# EAGLE design drive (EAGLE 5.11)
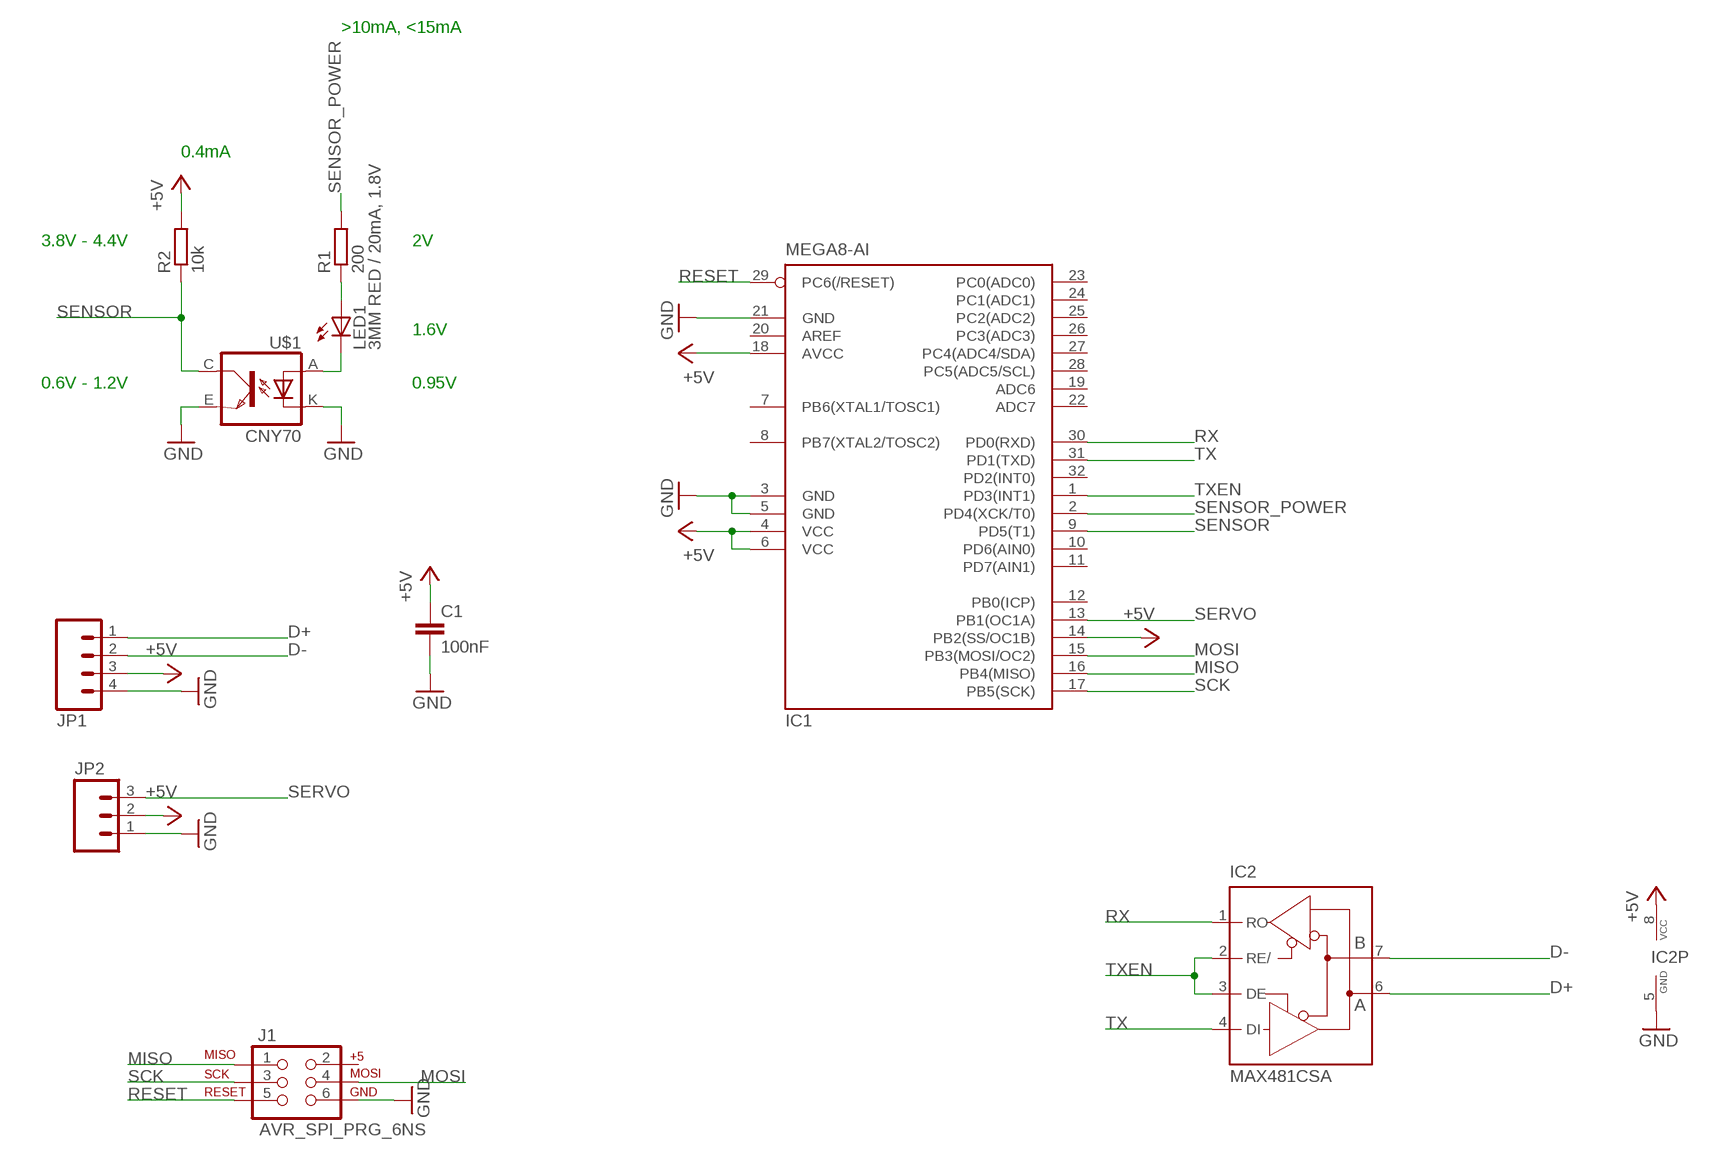
[diagram p0: schematic, sheet 1]

## Parts
C1  100nF  C-EUC0805  [C0805]
IC1  MEGA8-AI  [TQFP32-08]
IC2  MAX481CSA  [SO08]
J1  AVR_SPI_PRG_6NS  [2X3-NS]
JP1  M04POLAR  [MOLEX-1X4]
JP2  M03PTH  [1X03]
LED1  3MM RED / 20mA, 1.8V  LED3MM  [LED3MM]
R1  200  R-EU_R0805  [R0805]
R2  10k  R-EU_R0805  [R0805]
U$1  CNY70  [4]

## Nets
+5V: C1.1 IC1.4(VCC) IC1.6(VCC) IC1.14(PB2(SS/OC1B)) IC1.18(AVCC) IC2.8(VCC) JP1.3 JP2.2 R2.2
D+: IC2.6(A) JP1.1
D-: IC2.7(B) JP1.2
GND: C1.2 IC1.3(GND) IC1.5(GND) IC1.21(GND) IC2.5(GND) J1.6 JP1.4 JP2.1 U$1.E(EMI) U$1.K(C)
MISO: IC1.16(PB4(MISO)) J1.1
MOSI: IC1.15(PB3(MOSI/OC2)) J1.4
N$2: LED1.K(C) U$1.A
N$3: LED1.A R1.1
RESET: IC1.29(PC6(/RESET)) J1.5
RX: IC1.30(PD0(RXD)) IC2.1(RO)
SCK: IC1.17(PB5(SCK)) J1.3
SENSOR: IC1.9(PD5(T1)) R2.1 U$1.C(COL)
SENSOR_POWER: IC1.2(PD4(XCK/T0)) R1.2
SERVO: IC1.13(PB1(OC1A)) JP2.3
TX: IC1.31(PD1(TXD)) IC2.4(DI)
TXEN: IC1.1(PD3(INT1)) IC2.2(RE/) IC2.3(DE)
Unconnected: IC1.7(PB6(XTAL1/TOSC1)) IC1.8(PB7(XTAL2/TOSC2)) IC1.10(PD6(AIN0)) IC1.11(PD7(AIN1)) IC1.12(PB0(ICP)) IC1.19(ADC6) IC1.20(AREF) IC1.22(ADC7) IC1.23(PC0(ADC0)) IC1.24(PC1(ADC1)) IC1.25(PC2(ADC2)) IC1.26(PC3(ADC3)) IC1.27(PC4(ADC4/SDA)) IC1.28(PC5(ADC5/SCL)) IC1.32(PD2(INT0)) J1.2

## Notes on the sheet
- >10mA, <15mA
- 0.4mA
- 3.8V - 4.4V | 2V
- 1.6V
- 0.6V - 1.2V | 0.95V

## Library data of the parts
C1 = rcl:C-EU: CAPACITOR, European symbol
IC1 = atmel:MEGA8: MICROCONTROLLER 8 Kbytes FLASH, 1 kbytes SRAM, 512 bytes EEPROM, USART, 6-channel 10 bit ADC, 2-channel 8 bit ADC Pin compatible with Atmega48, ATMega88, ATMega168 Source: avr.lbr; MPN: ATMEGA8-16AU; OC_FARNELL: 9171371; OC_NEWARK: 73M8863
IC2 = maxim:MAX481CSA: RS485 TRANSEIVER; MF: MAXIM; MPN: MAX481CSA; OC_FARNELL: unknown; OC_NEWARK: 90C3817
J1 = SparkFun:AVR_SPI_PRG_6: AVR ISP 6 Pin This is the reduced ISP connector for AVR programming. Common on Arduino. This footprint will take up less PCB space and can be used with a 10-pin to 6-pin adapter such as SKU: BOB-08508
JP1 = SparkFun:M04: Header 4 Standard 4-pin 0.1" header. Use with straight break away headers (SKU : PRT-00116), right angle break away headers (PRT-00553), swiss pins (PRT-00743), machine pins (PRT-00117), and female headers (PRT-00115). Molex polarized connector foot print use with SKU : PRT-08231 with associated crimp pins and housings.
JP2 = SparkFun:M03: Header 3 Standard 3-pin 0.1" header. Use with straight break away headers (SKU : PRT-00116), right angle break away headers (PRT-00553), swiss pins (PRT-00743), machine pins (PRT-00117), and female headers (PRT-00115). Molex polarized connector foot print use with SKU : PRT-08232 with associated crimp pins and housings.
LED1 = led:LED: LED OSRAM: - CHIPLED LG R971, LG N971, LY N971, LG Q971, LY Q971, LO R971, LY R971 LH N974, LH R974 LS Q976, LO Q976, LY Q976 LO Q996 - Hyper CHIPLED LW Q18S LB Q993, LB Q99A, LB R99A - SideLED LS A670, LO A670, LY A670, LG A670, LP A670 LB A673, LV A673, LT A673, LW A673 LH A674 LY A675 LS A676, LA A676, LO A676, LY A676, LW A676 LS A679, LY A679, LG A679 - Hyper Micro SIDELED® LS Y876, LA Y876, LO Y876, LY Y876 LT Y87S - SmartLED LW L88C, LW L88S LB L89C, LB L89S, LG L890 LS L89K, LO L89K, LY L89K LS L896, LA L896, LO L896, LY L896 - TOPLED LS T670, LO T670, LY T670, LG T670, LP T670 LSG T670, LSP T670, LSY T670, LOP T670, LYG T670 LG T671, LOG T671, LSG T671 LB T673, LV T673, LT T673, LW T673 LH T674 LS T676, LA T676, LO T676, LY T676, LB T676, LH T676, LSB T676, LW T676 LB T67C, LV T67C, LT T67C, LS T67K, LO T67K, LY T67K, LW E67C LS E67B, LA E67B, LO E67B, LY E67B, LB E67C, LV E67C, LT E67C LW T67C LS T679, LY T679, LG T679 LS T770, LO T770, LY T770, LG T770, LP T770 LB T773, LV T773, LT T773, LW T773 LH T774 LS E675, LA E675, LY E675, LS T675 LS T776, LA T776, LO T776, LY T776, LB T776 LHGB T686 LT T68C, LB T68C - Hyper Mini TOPLED® LB M676 - Mini TOPLED Santana® LG M470 LS M47K, LO M47K, LY M47K Source: http://www.osram.convergy.de LUXEON: - LUMILED® LXK2-PW12-R00, LXK2-PW12-S00, LXK2-PW14-U00, LXK2-PW14-V00 LXK2-PM12-R00, LXK2-PM12-S00, LXK2-PM14-U00 LXK2-PE12-Q00, LXK2-PE12-R00, LXK2-PE12-S00, LXK2-PE14-T00, LXK2-PE14-U00 LXK2-PB12-K00, LXK2-PB12-L00, LXK2-PB12-M00, LXK2-PB14-N00, LXK2-PB14-P00, LXK2-PB14-Q00 LXK2-PR12-L00, LXK2-PR12-M00, LXK2-PR14-Q00, LXK2-PR14-R00 LXK2-PD12-Q00, LXK2-PD12-R00, LXK2-PD12-S00 LXK2-PH12-R00, LXK2-PH12-S00 LXK2-PL12-P00, LXK2-PL12-Q00, LXK2-PL12-R00 Source: www.luxeon.com KINGBRIGHT: KA-3528ASYC Source: www.kingbright.com
R1 R2 = rcl:R-EU_: RESISTOR, European symbol
U$1 = cny70:CNY70

## Board
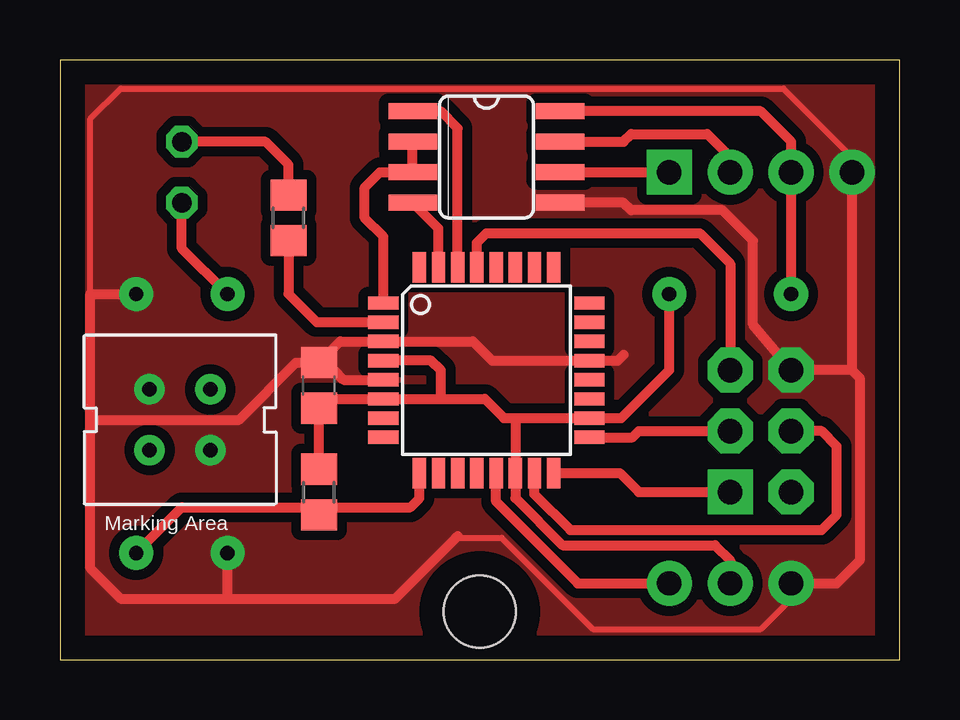
[diagram p1: board, top side]
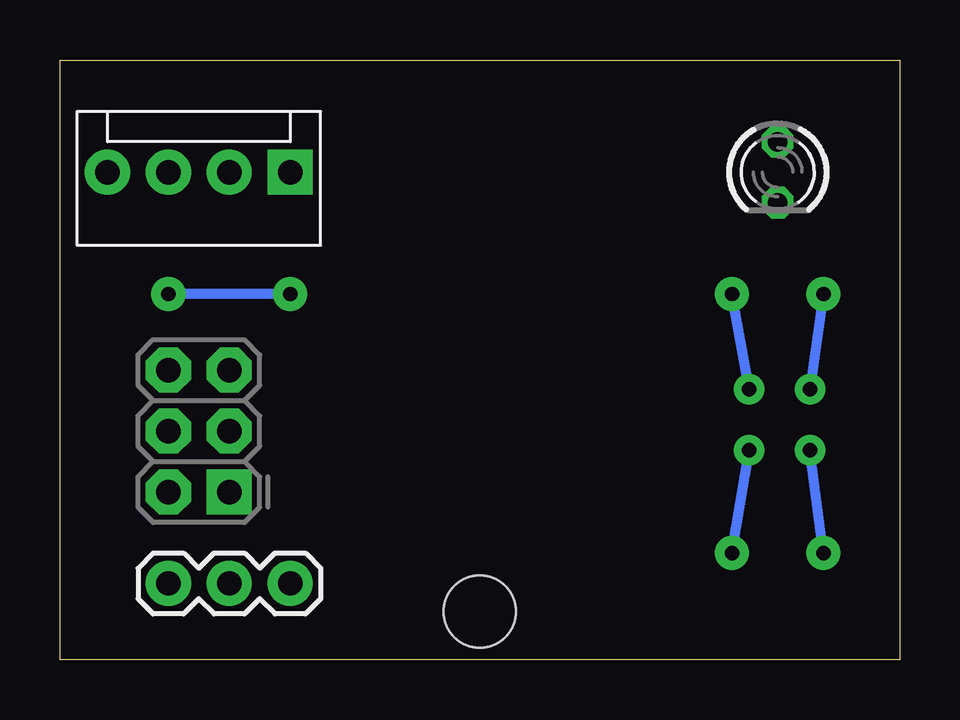
[diagram p2: board, bottom side, seen from below]

Size 35 x 25 mm. Coordinates in mm from the lower left corner, seen from the top.
Outline: 0,0 35,0 35,25 0,25 0,0
Copper layers (1*16): Top 0.035mm / dielectric 1.5mm / Bottom 0.035mm
Design rules "default *": minimum track width 0.25mm, minimum drill 0.5mm, track to track 8mil, track to pad 8mil, pad to pad 8mil, via to via 8mil, smd to smd 8mil, copper to edge 40mil, drill to drill 8mil, minimum pad ring 10mil, minimum via ring 8mil, stop-mask expansion 4mil, vias tented up to drill 0mil, thermal gap 10mil
Holes 3 mm at 17.5,2

### Footprints (pad centres in the part's own frame; a part is rotated, then mirrored left to right if it is on the bottom)
C0805 = smd 1.3 x 1.5: 1 -0.95,0; 2 0.95,0
TQFP32-08 = smd 1.27 x 0.559: 1 -4.293,2.8; 2 -4.293,2; 3 -4.293,1.2; 4 -4.293,0.4; 5 -4.293,-0.4; 6 -4.293,-1.2; 7 -4.293,-2; 8 -4.293,-2.8; 17 4.293,-2.8; 18 4.293,-2; 19 4.293,-1.2; 20 4.293,-0.4; 21 4.293,0.4; 22 4.293,1.2; 23 4.293,2; 24 4.293,2.8 | smd 0.559 x 1.27: 9 -2.8,-4.293; 10 -2,-4.293; 11 -1.2,-4.293; 12 -0.4,-4.293; 13 0.4,-4.293; 14 1.2,-4.293; 15 2,-4.293; 16 2.8,-4.293; 25 2.8,4.293; 26 2,4.293; 27 1.2,4.293; 28 0.4,4.293; 29 -0.4,4.293; 30 -1.2,4.293; 31 -2,4.293; 32 -2.8,4.293
SO08 = smd 0.66 x 2.032: 1 -1.905,-3.073; 2 -0.635,-3.073; 3 0.635,-3.073; 4 1.905,-3.073; 5 1.905,3.073; 6 0.635,3.073; 7 -0.635,3.073; 8 -1.905,3.073
2X3-NS = drill 1.016 pad 1.88 square: 1 -2.54,-1.27 | drill 1.016 pad 1.88 octagon: 2 -2.54,1.27; 3 0,-1.27; 4 0,1.27; 5 2.54,-1.27; 6 2.54,1.27
MOLEX-1X4 = drill 1.016 pad 1.88 square: 1 0,0 | drill 1.016 pad 1.88 round: 2 2.54,0; 3 5.08,0; 4 7.62,0
1X03 = drill 1.016 pad 1.88 round: 1 0,0; 2 2.54,0; 3 5.08,0
LED3MM = drill 0.813 octagon: A -1.27,0; K 1.27,0
R0805 = smd 1.3 x 1.5: 1 -0.95,0; 2 0.95,0
4 = drill 0.61 pad 1.27 round: A -1.27,1.27; C 1.27,-1.27; E 1.27,1.27; K -1.27,-1.27

### Placement (x,y rotation side)
C1  10.79,11.43 90 top
IC1  17.78,12.06 0 top
IC2  17.78,20.95 270 top
J1  29.21,9.53 90 bottom
JP1  25.4,20.32 180 bottom
JP2  30.48,3.17 0 bottom
LED1  5.08,20.32 270 bottom
R1  9.53,18.41 270 top
R2  12k  [R0805]  10.79,6.99 90 top
U$1  5,10 270 top

### Tracks (layer width: path | path; a pad name or v marks a point on that pad's centre or on a via)
+5V  (via drill 0.6 pad 1.42)
  Top 0.406: 15.88,10.87 IC1.6 11.18,10.87 | IC1.4 15.47,12.46 15.88,12.06 15.88,10.87 | C1.1 11.18,10.87 | 19.05,10.06 18.51,10.06 17.71,10.87 15.88,10.87 | 19.05,10.06 IC1.18 23.4,10.06 25.4,12.06 v25.4,15.24 | 19.05,10.06 18.98,9.99 IC1.14 18.98,6.74 20.95,4.76 27.3,4.76 27.94,4.13 JP2.2 | C1.1 arc-90 11.18,10.87 | IC2.8 29.21,22.86 30.48,21.59 JP1.3 v30.48,15.24 | R2.2 C1.1
  Bottom 0.406: v25.4,15.24 v30.48,15.24
D+
  Top 0.406: IC2.6 JP1.1
D-
  Top 0.406: IC2.7 23.5,21.59 23.81,21.91 26.99,21.91 27.94,20.95 JP1.2
GND  (via drill 0.6 pad 1.42)
  Top 0.254: JP2.1 30.48,2.54 29.21,1.27 22.23,1.27 18.41,5.08 16.51,5.08 | JP1.4 33.02,20.95 30.16,23.81 2.54,23.81 1.27,22.54 1.27,15.24
  Top 0.406: C1.2 11.11,12.06 11.43,12.06 11.83,11.66 IC1.5 | C1.2 11.68,13.27 IC1.3 17.21,13.27 18.02,12.46 IC1.21 23.26,12.46 23.5,12.7 | 6.99,2.54 2.54,2.54 1.27,3.81 1.27,10 | 6.99,2.54 v6.99,4.45 | JP2.1 32.38,3.17 33.34,4.13 33.34,11.75 33.02,12.06 | JP1.4 33.02,12.06 | 33.02,12.06 J1.6 28.89,13.97 28.89,17.46 27.62,18.73 23.81,18.73 23.5,19.05 IC2.5 | 1.27,10 1.27,15.24 v3.17,15.24 | C1.2 9.84,12.38 7.46,10 1.27,10 | 16.58,5.15 16.51,5.08 13.97,2.54 6.99,2.54
  Bottom 0.406: v3.17,15.24 U$1.K | v6.99,4.45 U$1.E
  pour Top (isolate 0.406, no thermals): 0,25.4 0,0 35.24,0 35.24,25.4
MISO
  Top 0.406: IC1.16 23.34,7.77 24.13,6.99 J1.1
MOSI
  Top 0.406: J1.4 31.75,9.53 32.38,8.89 32.38,6.03 31.75,5.4 21.27,5.4 19.78,6.89 IC1.15
N$2  (via drill 0.6 pad 1.42)
  Top 0.406: v6.99,15.24 5.08,17.14 LED1.K
  Bottom 0.406: U$1.A v6.99,15.24
N$3
  Top 0.406: LED1.A 8.57,21.59 9.53,20.64 R1.1
RESET
  Top 0.406: IC1.29 17.38,17.38 17.78,17.78 26.67,17.78 27.94,16.51 J1.5
RX
  Top 0.406: IC1.30 16.58,22.16 15.88,22.86 IC2.1
SCK
  Top 0.406: IC1.17 23.87,9.27 24.13,9.53 J1.3
SENSOR  (via drill 0.6 pad 1.42)
  Top 0.406: v3.17,4.45 5.08,6.35 10.79,6.35 | IC1.9 14.98,6.72 14.61,6.35 10.79,6.35 | 10.79,6.35 R2.1
  Bottom 0.406: v3.17,4.45 U$1.C
SENSOR_POWER
  Top 0.406: IC1.2 10.7,14.06 9.53,15.24 R1.2
SERVO
  Top 0.406: JP2.3 21.59,3.17 18.18,6.58 IC1.13
TX
  Top 0.406: IC1.31 15.78,17.98 IC2.4
TXEN
  Top 0.406: IC2.2 IC2.3 13.34,20.32 12.7,19.68 12.7,18.41 13.49,17.63 IC1.1